# EAGLE design MikeFornoff_NFC_Card (EAGLE 9.3.0)
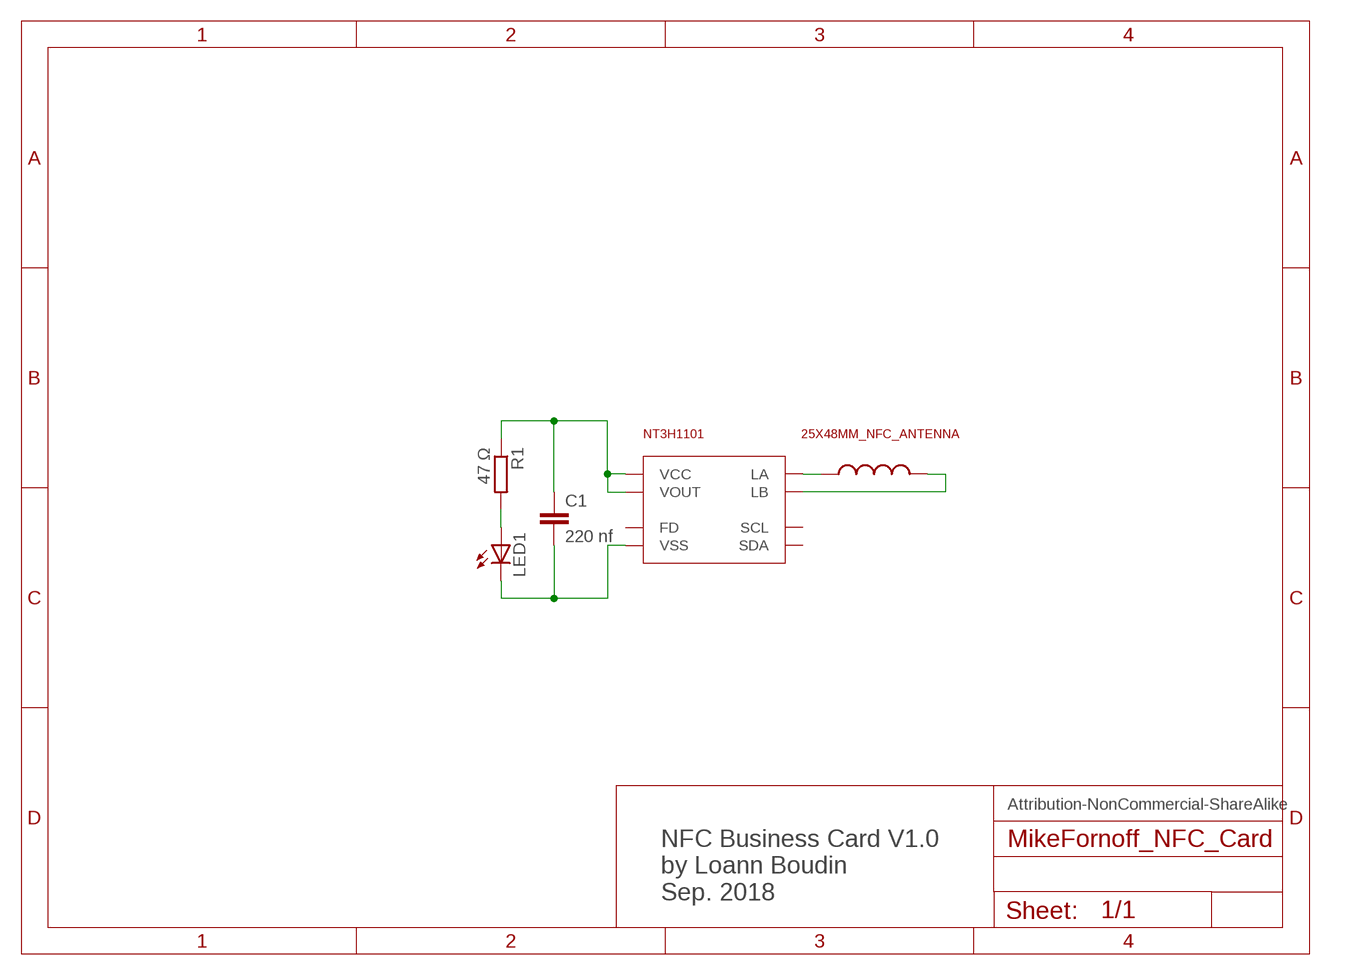
[diagram p0: schematic, sheet 1]

## Parts
ANT  25X48MM_NFC_ANTENNA  [25X48MM_NFC]
C1  220 nf  C-EUC0603  [C0603]
LED1  LEDSML0805  [SML0805]
NT3H1101  NT3H  [XQFN8]
R1  47 Ω  R-EU_R0603  [R0603]

## Nets
N$1: ANT.P$2 NT3H1101.LA
N$2: ANT.P$1 NT3H1101.LB
N$3: C1.1 NT3H1101.VCC NT3H1101.VOUT R1.1
N$4: LED1.A R1.2
N$6: C1.2 LED1.C NT3H1101.VSS
Unconnected: NT3H1101.FD NT3H1101.SCL NT3H1101.SDA

## Notes on the sheet
- Attribution-NonCommercial-ShareAlike
- NFC Business Card V1.0
  by Loann Boudin
  Sep. 2018

## Library data of the parts
ANT = PCB_BusinessCard:25X48MM_NFC_ANTENNA: 25x48 mm NFC loop antenna, L = 2,75 µH
C1 = resistor:C-EU: CAPACITOR, European symbol
LED1 = led:LED: LED OSRAM: - CHIPLED LG R971, LG N971, LY N971, LG Q971, LY Q971, LO R971, LY R971 LH N974, LH R974 LS Q976, LO Q976, LY Q976 LO Q996 - Hyper CHIPLED LW Q18S LB Q993, LB Q99A, LB R99A - SideLED LS A670, LO A670, LY A670, LG A670, LP A670 LB A673, LV A673, LT A673, LW A673 LH A674 LY A675 LS A676, LA A676, LO A676, LY A676, LW A676 LS A679, LY A679, LG A679 - Hyper Micro SIDELED® LS Y876, LA Y876, LO Y876, LY Y876 LT Y87S - SmartLED LW L88C, LW L88S LB L89C, LB L89S, LG L890 LS L89K, LO L89K, LY L89K LS L896, LA L896, LO L896, LY L896 - TOPLED LS T670, LO T670, LY T670, LG T670, LP T670 LSG T670, LSP T670, LSY T670, LOP T670, LYG T670 LG T671, LOG T671, LSG T671 LB T673, LV T673, LT T673, LW T673 LH T674 LS T676, LA T676, LO T676, LY T676, LB T676, LH T676, LSB T676, LW T676 LB T67C, LV T67C, LT T67C, LS T67K, LO T67K, LY T67K, LW E67C LS E67B, LA E67B, LO E67B, LY E67B, LB E67C, LV E67C, LT E67C LW T67C LS T679, LY T679, LG T679 LS T770, LO T770, LY T770, LG T770, LP T770 LB T773, LV T773, LT T773, LW T773 LH T774 LS E675, LA E675, LY E675, LS T675 LS T776, LA T776, LO T776, LY T776, LB T776 LHGB T686 LT T68C, LB T68C - Hyper Mini TOPLED® LB M676 - Mini TOPLED Santana® LG M470 LS M47K, LO M47K, LY M47K Source: http://www.osram.convergy.de LUXEON: - LUMILED® LXK2-PW12-R00, LXK2-PW12-S00, LXK2-PW14-U00, LXK2-PW14-V00 LXK2-PM12-R00, LXK2-PM12-S00, LXK2-PM14-U00 LXK2-PE12-Q00, LXK2-PE12-R00, LXK2-PE12-S00, LXK2-PE14-T00, LXK2-PE14-U00 LXK2-PB12-K00, LXK2-PB12-L00, LXK2-PB12-M00, LXK2-PB14-N00, LXK2-PB14-P00, LXK2-PB14-Q00 LXK2-PR12-L00, LXK2-PR12-M00, LXK2-PR14-Q00, LXK2-PR14-R00 LXK2-PD12-Q00, LXK2-PD12-R00, LXK2-PD12-S00 LXK2-PH12-R00, LXK2-PH12-S00 LXK2-PL12-P00, LXK2-PL12-Q00, LXK2-PL12-R00 Source: www.luxeon.com KINGBRIGHT: KA-3528ASYC Source: www.kingbright.com
NT3H1101 = PCB_BusinessCard:NT3H
R1 = resistor:R-EU_: RESISTOR, European symbol

## Board
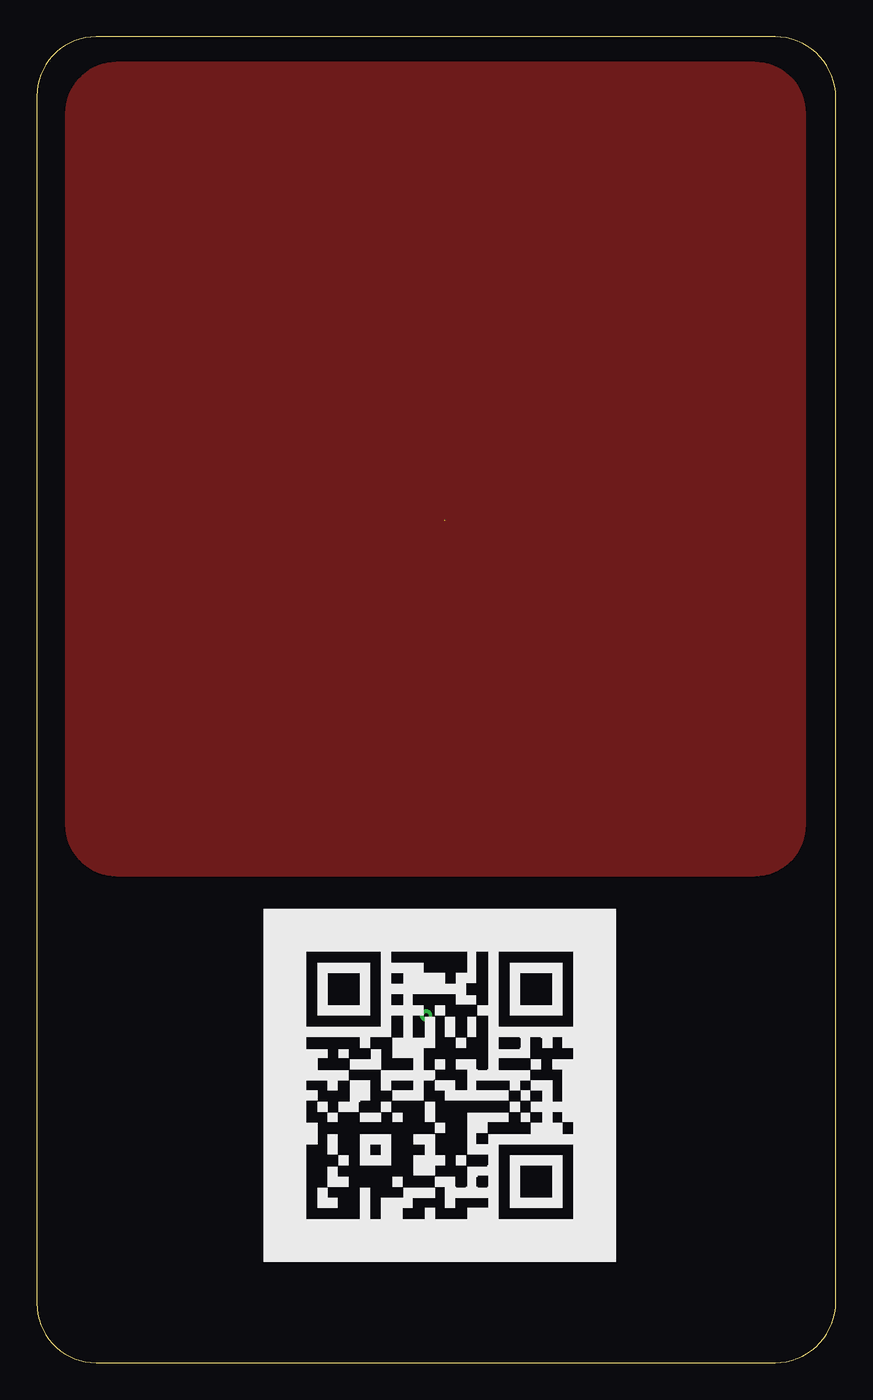
[diagram p1: board, top side]
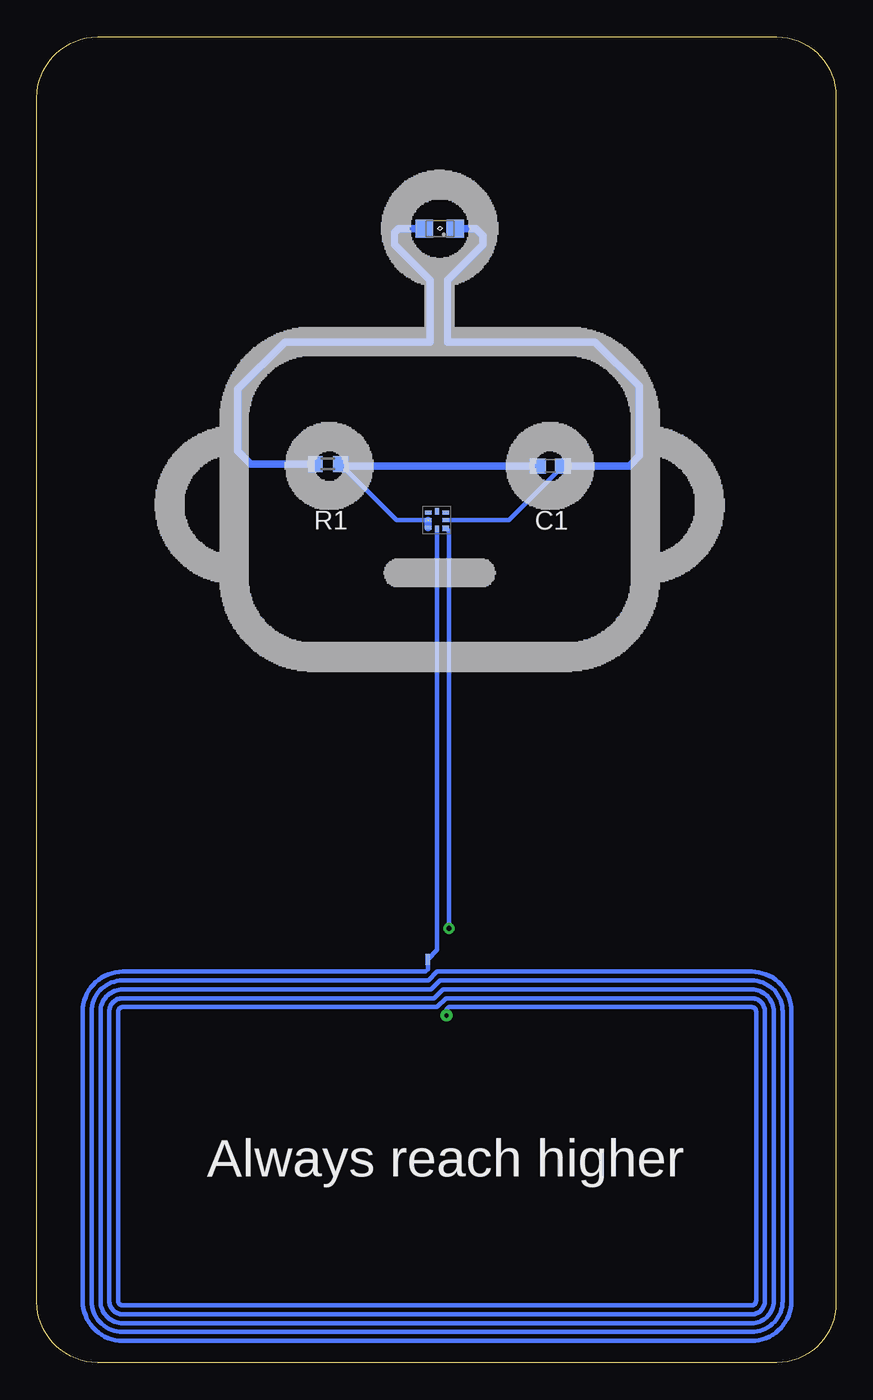
[diagram p2: board, bottom side, seen from below]

Size 54.1 x 89.76 mm. Coordinates in mm from the lower left corner, seen from the top.
Outline: 0,85.76 0,4 arc90 4,0 50,0 arc90 54.1,4.11 54.1,85.66 arc90 50,89.76 4,89.76 arc90 0,85.76
Copper layers (1*16): Top 0.035mm / dielectric 1.5mm / Bottom 0.035mm
Design rules "default": minimum track width 6mil, minimum drill 0.35mm, track to track 6mil, track to pad 6mil, pad to pad 6mil, via to via 6mil, smd to smd 6mil, copper to edge 40mil, drill to drill 6mil, minimum pad ring 10mil, minimum via ring 8mil, stop-mask expansion 4mil, vias tented up to drill 0mil, thermal gap 10mil

### Footprints (pad centres in the part's own frame; a part is rotated, then mirrored left to right if it is on the bottom)
25X48MM_NFC = smd 0.3 x 0.75: P$1 -0.635,13.335 | drill 0.3: P$2 0.635,9.525
C0603 = smd 1.1 x 1: 1 -0.85,0; 2 0.85,0
SML0805 = smd 1.2 x 1.2: A 1.05,0; C -1.05,0
XQFN8 = smd 0.27 x 0.45: FD 0,-0.6; LB 0,0.6 | smd 0.45 x 0.37: LA -0.6,0.55 | smd 0.45 x 0.27: SCL -0.6,-0.5; SDA 0.6,-0.5; VCC 0.6,0; VOUT 0.6,0.5; VSS -0.6,0
R0603 = smd 1 x 1.1: 1 -0.85,0; 2 0.85,0

### Placement (x,y rotation side)
ANT  27,13.97 0 bottom
C1  19.33,60.71 0 bottom
LED1  26.82,76.78 180 bottom
NT3H1101  27.01,57.05 180 bottom
R1  34.4,60.84 180 bottom

### Tracks (layer width: path | path; a pad name or v marks a point on that pad's centre or on a via)
N$1  (via drill 0.35)
  Top 0.305: ANT.P$2 26.2,23.66 25.74,23.66 25.2,24.2 25.2,26.2 24.7,26.7 24,26.7 23.7,27 23.7,28.1 24.4,28.8 25.6,28.8 v26.2,29.4
  Bottom 0.305: NT3H1101.LA 26.2,56.29 v26.2,29.4
N$2
  Bottom 0.305: ANT.P$1 27.01,27.93 NT3H1101.LB
N$3  (1 unrouted)
  Bottom 0.305: NT3H1101.VCC 29.76,57.05 33.42,60.71
  Bottom 0.508: C1.1 33.42,60.71 R1.1 | 27.61,57.01 NT3H1101.VOUT
N$4
  Bottom 0.508: LED1.A 29.62,76.78 29.9,76.5 29.9,75.7 27.5,73.3 27.5,69.1 37.3,69.1 40.5,65.9 40.5,61.7 39.64,60.84 R1.2
N$6
  Bottom 0.305: NT3H1101.VSS 22.14,57.05 C1.2
  Bottom 0.508: LED1.C 24.38,76.78 23.9,76.3 23.9,75.7 26.3,73.3 26.3,69.1 16.3,69.1 13.3,66.1 13.3,61.4 13.99,60.71 C1.2
TOP1
  pour Top: 52,84.59 52,36.41 arc-90 48.59,33 5.41,33 arc-90 2,36.41 2,84.59 arc-90 5.41,88 48.59,88 arc-90

### Text on the board
bPlace: Always reach higher
tStop: Engineer, Inventor, Dreamer / mikefornoff@gmail.com / C:(586) 924-9051 | MIKE FORNOFF | "If you can't explain it simply, / you don't understand it well enough."